# EAGLE design Relay 2 Board v1.0 (EAGLE 7.4.0)
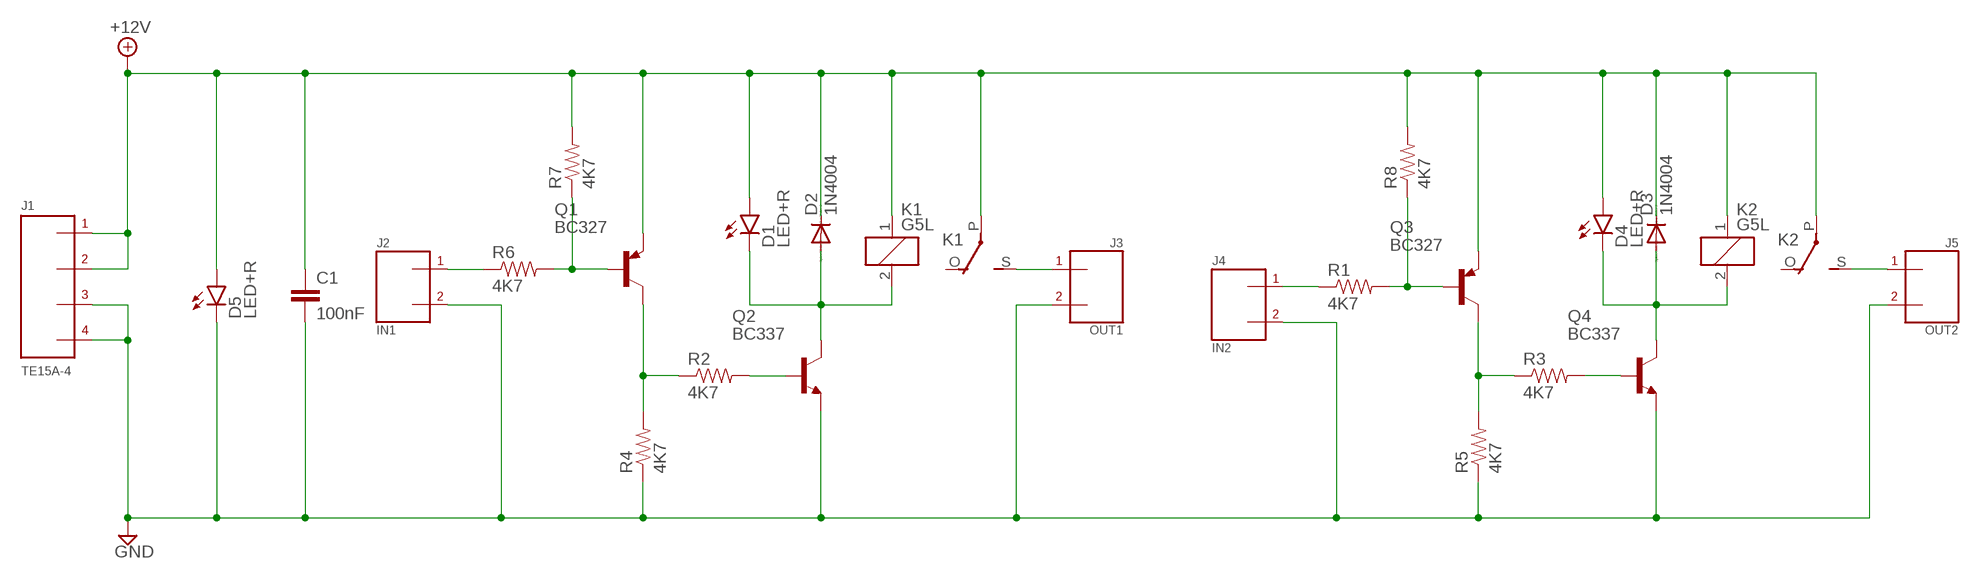
[diagram p0: schematic, sheet 1]

## Parts
C1  100nF  CAPPTH1  [CAP-PTH-5MM]
D1  LED+R  LED3MM  [LED3MM]
D2  1N4004  [DO41-10]
D3  1N4004  [DO41-10]
D4  LED+R  LED3MM  [LED3MM]
D5  LED+R  LED3MM  [LED3MM]
J1  TE15A-4  [J4-950MM]
J2  IN1  J2-508MMV  [J2V-508MM]
J3  OUT1  J2-508MMV  [J2V-508MM]
J4  IN2  J2-508MMV  [J2V-508MM]
J5  OUT2  J2-508MMV  [J2V-508MM]
K1  G5L  [G5LE]
K2  G5L  [G5LE]
Q1  BC327  [TO92]
Q2  BC337  [TO92]
Q3  BC327  [TO92]
Q4  BC337  [TO92]
R1  4K7  RESISTORAXIAL-0.3  [AXIAL-0.3]
R2  4K7  RESISTORAXIAL-0.3  [AXIAL-0.3]
R3  4K7  RESISTORAXIAL-0.3  [AXIAL-0.3]
R4  4K7  RESISTORAXIAL-0.3  [AXIAL-0.3]
R5  4K7  RESISTORAXIAL-0.3  [AXIAL-0.3]
R6  4K7  RESISTORAXIAL-0.3  [AXIAL-0.3]
R7  4K7  RESISTORAXIAL-0.3  [AXIAL-0.3]
R8  4K7  RESISTORAXIAL-0.3  [AXIAL-0.3]

## Nets
+12V: C1.1 D1.A D2.C D3.C D4.A D5.A J1.P$1 J1.P$2 K1.1 K1.P(2:P) K2.1 K2.P(2:P) Q1.1(E) Q3.1(E) R7.P$2 R8.P$2
GND: C1.2 D5.K(C) J1.P$3 J1.P$4 J2.P$2 J3.P$2 J4.P$2 J5.P$2 Q2.1(E) Q4.1(E) R4.P$1 R5.P$1
N$1: Q3.2(B) R1.P$2 R8.P$1
N$4: D1.K(C) D2.A K1.2 Q2.3(C)
N$6: Q2.2(B) R2.P$2
N$7: Q1.3(C) R2.P$1 R4.P$2
N$8: J5.P$1 K2.S(2:S)
N$9: Q1.2(B) R6.P$2 R7.P$1
N$10: J2.P$1 R6.P$1
N$11: J3.P$1 K1.S(2:S)
N$12: Q4.2(B) R3.P$2
N$13: Q3.3(C) R3.P$1 R5.P$2
N$15: J4.P$1 R1.P$1
N$17: D3.A D4.K(C) K2.2 Q4.3(C)
Unconnected: K1.O(2:O) K2.O(2:O)

## Library data of the parts
C1 = SparkFun-Passives:CAP: Capacitor Standard 0603 ceramic capacitor, and 0.1" leaded capacitor.
D1 D4 D5 = SparkFun-LED:LED: LEDs Standard schematic elements and footprints for 5mm, 3mm, 1206, and 0603 sized LEDs. 5mm - Spark Fun Electronics SKU : COM-00529 (and others)
D2 D3 = diode:1N4004: DIODE general purpose rectifier, 1 A
J1 = aaa-flatcatit:TE15A-4: TE 15A 4 way connector
J2-J5 = aaa-flatcatit:J2-508MM: J2 5.08mm 12A Connector
K1 K2 = relay:G5L: RELAY 1 x switch, 10 A/120 V AC, 8 A/30 V ADC, Omron; OC_FARNELL: unknown; OC_NEWARK: unknown
Q1 Q3 = transistor-pnp:BC327: PNP Transistor
Q2 Q4 = transistor:BC337: NPN TRANSISTOR
R1-R8 = SparkFun-Resistors:RESISTOR: Resistor Basic schematic elements and footprints for 0603, 1206, and PTH resistors.

## Board
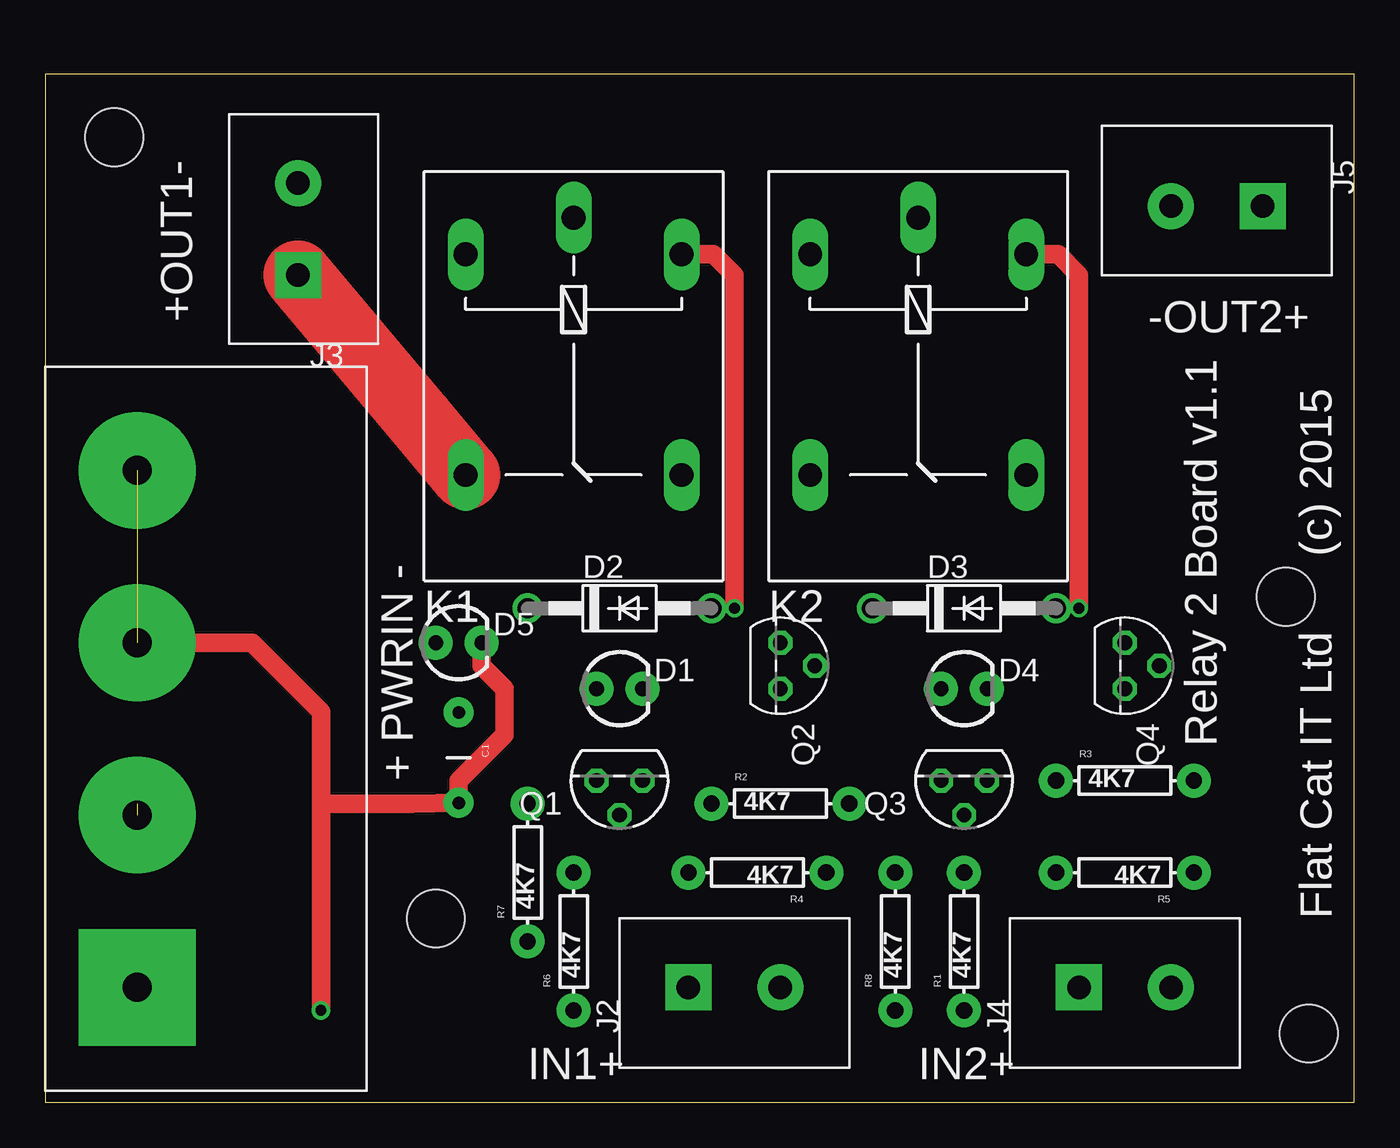
[diagram p1: board, top side]
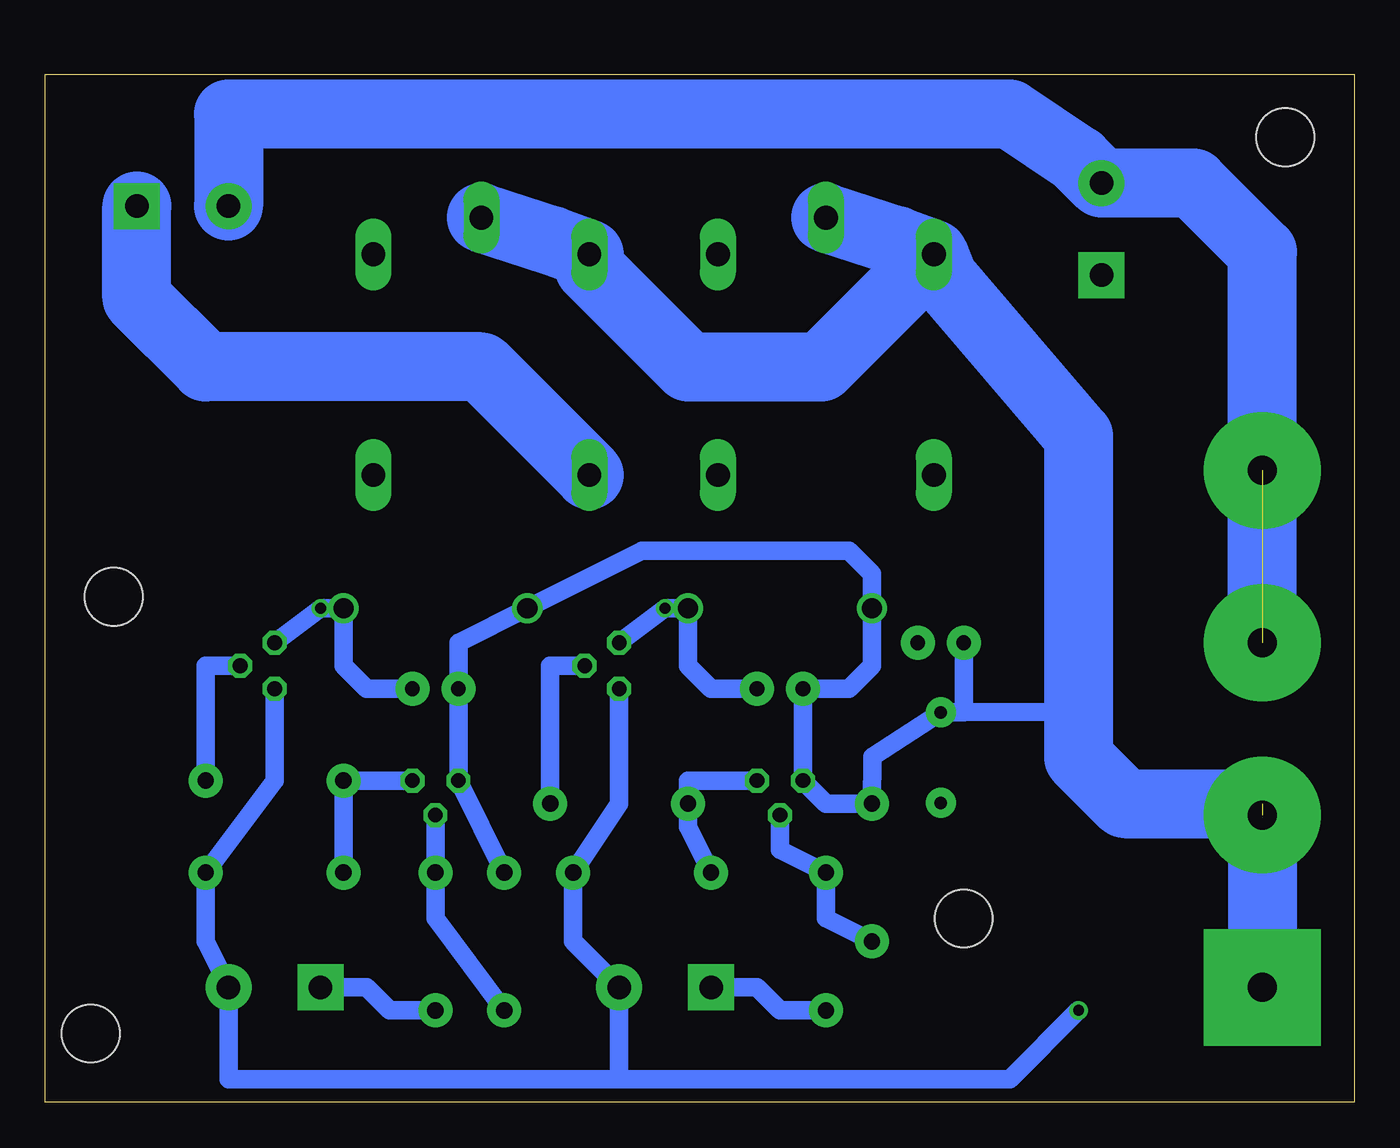
[diagram p2: board, bottom side, seen from below]

Size 72.37 x 56.82 mm. Coordinates in mm from the lower left corner, seen from the top.
Outline: 0,0 72.37,0 72.37,56.82 0,56.82 0,0
Copper layers (1*16): Top 0.035mm / dielectric 1.5mm / Bottom 0.035mm
Design rules "default": minimum track width 10mil, minimum drill 24mil, track to track 8mil, track to pad 8mil, pad to pad 8mil, via to via 8mil, smd to smd 8mil, copper to edge 40mil, drill to drill 8mil, minimum pad ring 10mil, minimum via ring 8mil, stop-mask expansion 4mil, vias tented up to drill 0mil, thermal gap 10mil
Holes 3.2 mm at 3.81,53.34 68.58,27.94 69.85,3.81 21.59,10.16

### Footprints (pad centres in the part's own frame; a part is rotated, then mirrored left to right if it is on the bottom)
CAP-PTH-5MM = drill 0.7 pad 1.651: 1 -2.5,0; 2 2.5,0
LED3MM = drill 0.813 pad 1.88: A -1.27,0; K 1.27,0
DO41-10 = drill 1.118: A 5.08,0; C -5.08,0
J4-950MM = drill 1.6 pad 6.452 square: P$1 0,0 | drill 1.6 pad 6.452: P$2 9.525,0; P$3 19.05,0; P$4 28.575,0
J2V-508MM = drill 1.3 pad 2.54 square: P$1 0,0 | drill 1.3 pad 2.54: P$2 5.08,0
G5LE = drill 1.321 long: 1 -7.493,-5.969; 2 -7.493,5.969; O 4.699,5.969; P -9.525,0; S 4.699,-5.969
TO92 = drill 0.813 octagon: 1 1.27,0; 2 0,1.905; 3 -1.27,0
AXIAL-0.3 = drill 0.9 pad 1.88: P$1 -3.81,0; P$2 3.81,0

### Placement (x,y rotation side)
C1  22.86,19.05 270 top
D1  31.75,22.86 0 top
D2  31.75,27.3 0 top
D3  50.8,27.3 0 top
D4  50.8,22.86 0 top
D5  22.86,25.4 0 top
J1  5.08,6.35 90 top
J2  35.56,6.35 0 top
J3  13.97,45.72 90 top
J4  57.15,6.35 0 top
J5  67.31,49.53 180 top
K1  29.21,39.37 270 top
K2  48.26,39.37 270 top
Q1  31.75,17.78 180 top
Q2  40.64,24.13 270 top
Q3  50.8,17.78 180 top
Q4  59.69,24.13 270 top
R1  50.8,8.89 90 top
R2  40.64,16.51 0 top
R3  59.69,17.78 0 top
R4  39.37,12.7 180 top
R5  59.69,12.7 180 top
R6  29.21,8.89 90 top
R7  26.67,12.7 90 top
R8  46.99,8.89 90 top

### Tracks (layer width: path | path; a pad name or v marks a point on that pad's centre or on a via)
+12V  (1 unrouted)
  Bottom 1.016: 15.24,19.05 16.47,21.59 21.59,21.56 | 21.59,21.56 C1.1 26.63,19.09 R7.P$2 29.21,16.51 Q1.1 D1.A 27.94,22.86 26.67,24.13 D2.C 26.67,29.21 27.94,30.48 39.37,30.48 D3.C 49.53,25.4 D4.A Q3.1 R8.P$2 | D5.A 21.59,21.56 | 21.59,21.56
  Bottom 3.81: J1.P$1 5.08,16.51 12.7,16.51 15.24,19.05 15.24,36.83 22.73,45.59 K1.1 | K1.P 25.27,47.62 K1.1 | K2.P 44.32,47.62 K2.1 42.29,46.1 36.83,40.64 29.46,40.64 K1.1
GND  (via drill 0.6)  (1 unrouted)
  Top 1.016: J1.P$3 11.43,25.4 15.24,21.59 15.24,16.51 | 15.24,16.51 20.28,16.51 C1.2 22.86,17.78 25.4,20.32 25.4,22.86 24.13,24.13 D5.K | 15.24,16.51 v15.24,5.08
  Bottom 1.016: Q4.1 59.69,17.78 R5.P$1 63.5,8.89 J4.P$2 62.23,1.27 40.64,1.27 | Q2.1 40.64,16.51 R4.P$1 43.18,8.89 J2.P$2 40.64,1.27 | v15.24,5.08 19.05,1.27 40.64,1.27
  Bottom 3.81: J1.P$3 5.08,46.99 8.89,50.8 J3.P$2 15.24,52.07 19.05,54.61 62.23,54.61 J5.P$2
N$1
  Bottom 1.016: Q3.2 R1.P$2 50.8,10.16 R8.P$1
N$4  (via drill 0.6)
  Top 1.016: K1.2 36.96,46.86 38.1,45.72 v38.1,27.3
  Bottom 1.016: Q2.3 v38.1,27.3 D2.A 36.83,24.13 35.56,22.86 D1.K
N$6
  Bottom 1.016: Q2.2 44.45,24.13 R2.P$2
N$7
  Bottom 1.016: R4.P$2 36.83,15.24 R2.P$1 36.83,17.78 Q1.3
N$8
  Bottom 3.81: K2.S 48.26,40.64 63.5,40.64 67.31,44.45 J5.P$1
N$9
  Bottom 1.016: Q1.2 31.75,13.97 R6.P$2 29.21,10.16 R7.P$1
N$10
  Bottom 1.016: J2.P$1 33.02,6.35 31.75,5.08 R6.P$1
N$11
  Top 3.81: K1.S 20.7,37.72 J3.P$1
N$12
  Bottom 1.016: Q4.2 63.5,24.13 R3.P$2
N$13
  Bottom 1.016: Q3.3 R3.P$1 R5.P$2
N$15
  Bottom 1.016: J4.P$1 54.61,6.35 53.34,5.08 R1.P$1
N$17  (via drill 0.6)
  Top 1.016: K2.2 56.01,46.86 57.15,45.72 v57.15,27.3
  Bottom 1.016: Q4.3 v57.15,27.3 D3.A 55.88,24.13 54.61,22.86 D4.K

### Text on the board
tNames: +OUT1- | -OUT2+ | Relay 2 Board v1.1 | + PWRIN - | Flat Cat IT Ltd (c) 2015 | IN1+ | IN2+